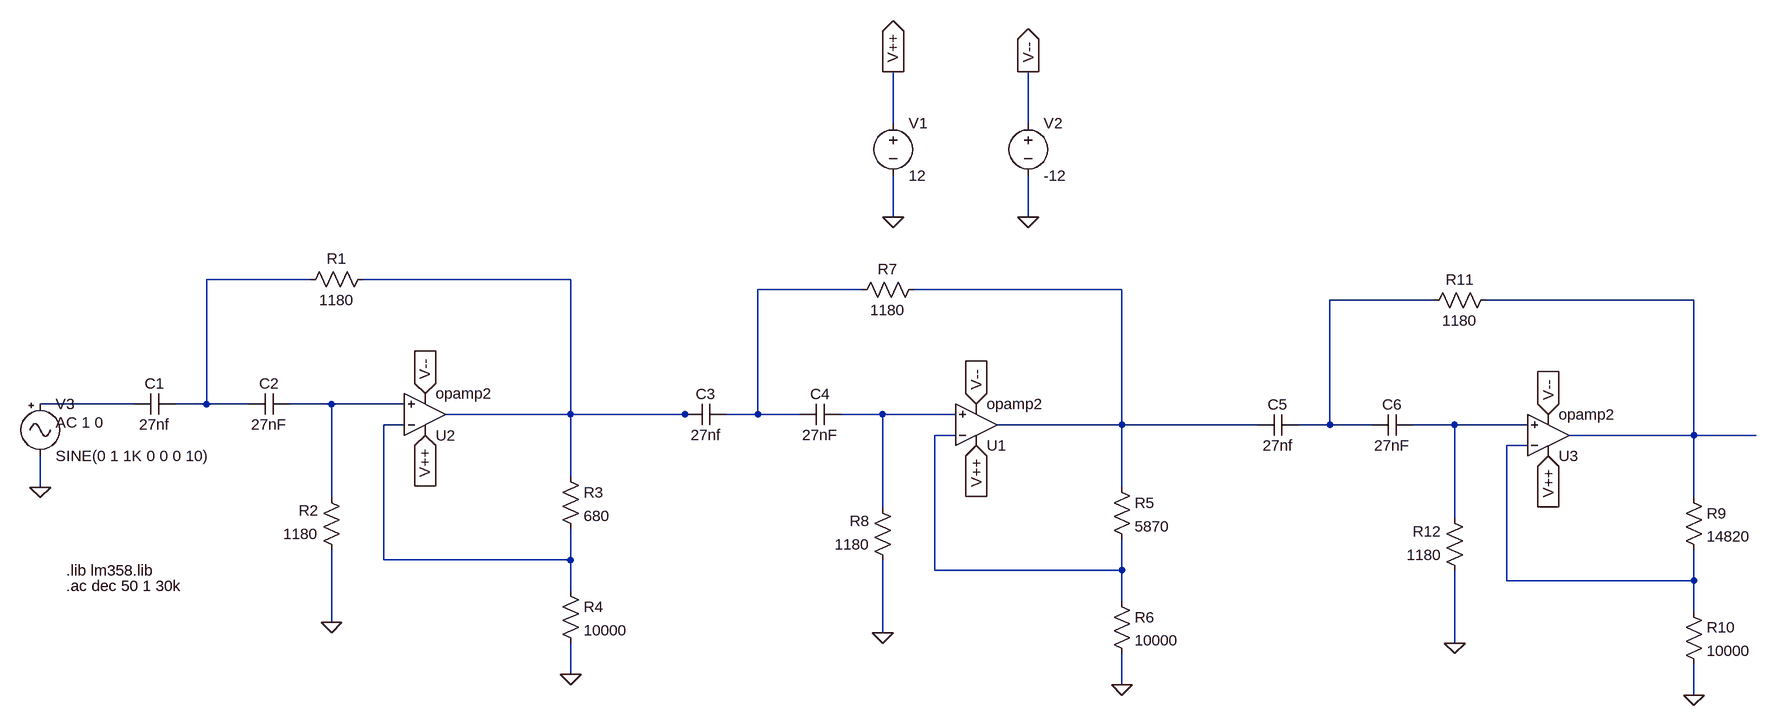
[diagram p0: schematic EEE3090F_2023_highPassFilter_GNGJOA003.asc]
EEE3090F_2023_highPassFilter_GNGJOA003.asc, the LTspice schematic file:
Version 4
SHEET 1 3012 680
WIRE 1072 -608 1072 -688
WIRE 1280 -608 1280 -688
WIRE 1072 -464 1072 -528
WIRE 1280 -464 1280 -528
WIRE 176 -368 16 -368
WIRE 576 -368 256 -368
WIRE 1024 -352 864 -352
WIRE 1424 -352 1104 -352
WIRE 1904 -336 1744 -336
WIRE 2304 -336 1984 -336
WIRE -96 -176 -240 -176
WIRE 16 -176 16 -368
WIRE 16 -176 -32 -176
WIRE 80 -176 16 -176
WIRE 208 -176 144 -176
WIRE 320 -176 208 -176
WIRE 576 -160 576 -368
WIRE 576 -160 384 -160
WIRE 752 -160 576 -160
WIRE 768 -160 752 -160
WIRE 864 -160 864 -352
WIRE 864 -160 816 -160
WIRE 928 -160 864 -160
WIRE 1056 -160 992 -160
WIRE 1168 -160 1056 -160
WIRE 320 -144 288 -144
WIRE 1424 -144 1424 -352
WIRE 1424 -144 1232 -144
WIRE 1632 -144 1424 -144
WIRE 1744 -144 1744 -336
WIRE 1744 -144 1696 -144
WIRE 1808 -144 1744 -144
WIRE 1936 -144 1872 -144
WIRE 2048 -144 1936 -144
WIRE 1168 -128 1136 -128
WIRE 2304 -128 2304 -336
WIRE 2304 -128 2112 -128
WIRE 2400 -128 2304 -128
WIRE 2048 -112 2016 -112
WIRE 576 -64 576 -160
WIRE -240 -48 -240 -96
WIRE 1424 -48 1424 -144
WIRE 208 -32 208 -176
WIRE 2304 -32 2304 -128
WIRE 1056 -16 1056 -160
WIRE 1936 0 1936 -144
WIRE 288 64 288 -144
WIRE 576 64 576 16
WIRE 576 64 288 64
WIRE 1136 80 1136 -128
WIRE 1424 80 1424 32
WIRE 1424 80 1136 80
WIRE 2016 96 2016 -112
WIRE 2304 96 2304 48
WIRE 2304 96 2016 96
WIRE 576 112 576 64
WIRE 1424 128 1424 80
WIRE 2304 144 2304 96
WIRE 208 160 208 48
WIRE 1056 176 1056 64
WIRE 1936 192 1936 80
WIRE 576 240 576 192
WIRE 1424 256 1424 208
WIRE 2304 272 2304 224
FLAG 208 160 0
FLAG 576 240 0
FLAG 352 -192 V--
IOPIN 352 -192 In
FLAG 352 -128 V++
IOPIN 352 -128 In
FLAG 1072 -464 0
FLAG 1280 -464 0
FLAG -240 -48 0
FLAG 1072 -688 V++
IOPIN 1072 -688 Out
FLAG 1280 -688 V--
IOPIN 1280 -688 Out
FLAG 1056 176 0
FLAG 1424 256 0
FLAG 1200 -176 V--
IOPIN 1200 -176 In
FLAG 1200 -112 V++
IOPIN 1200 -112 In
FLAG 1936 192 0
FLAG 2304 272 0
FLAG 2080 -160 V--
IOPIN 2080 -160 In
FLAG 2080 -96 V++
IOPIN 2080 -96 In
SYMBOL OpAmps\\opamp2 352 -96 M180
SYMATTR InstName U2
SYMBOL res 560 -80 R0
SYMATTR InstName R3
SYMATTR Value 680
SYMBOL res 560 96 R0
SYMATTR InstName R4
SYMATTR Value 10000
SYMBOL voltage 1072 -624 R0
WINDOW 123 0 0 Left 0
WINDOW 39 0 0 Left 0
SYMATTR InstName V1
SYMATTR Value 12
SYMBOL voltage 1280 -624 R0
WINDOW 123 0 0 Left 0
WINDOW 39 0 0 Left 0
SYMATTR InstName V2
SYMATTR Value -12
SYMBOL Misc\\signal -240 -192 R0
WINDOW 123 24 44 Left 2
WINDOW 39 0 0 Left 0
SYMATTR Value2 AC 1 0
SYMATTR InstName V3
SYMATTR Value SINE(0 1 1K 0 0 0 10)
SYMBOL cap -32 -192 R90
WINDOW 0 0 32 VBottom 2
WINDOW 3 32 32 VTop 2
SYMATTR InstName C1
SYMATTR Value 27nf
SYMBOL cap 144 -192 R90
WINDOW 0 0 32 VBottom 2
WINDOW 3 32 32 VTop 2
SYMATTR InstName C2
SYMATTR Value 27nF
SYMBOL res 272 -384 R90
WINDOW 0 0 56 VBottom 2
WINDOW 3 32 56 VTop 2
SYMATTR InstName R1
SYMATTR Value 1180
SYMBOL res 224 64 R180
WINDOW 0 36 76 Left 2
WINDOW 3 36 40 Left 2
SYMATTR InstName R2
SYMATTR Value 1180
SYMBOL OpAmps\\opamp2 1200 -80 M180
SYMATTR InstName U1
SYMBOL res 1408 -64 R0
SYMATTR InstName R5
SYMATTR Value 5870
SYMBOL res 1408 112 R0
SYMATTR InstName R6
SYMATTR Value 10000
SYMBOL cap 816 -176 R90
WINDOW 0 0 32 VBottom 2
WINDOW 3 32 32 VTop 2
SYMATTR InstName C3
SYMATTR Value 27nf
SYMBOL cap 992 -176 R90
WINDOW 0 0 32 VBottom 2
WINDOW 3 32 32 VTop 2
SYMATTR InstName C4
SYMATTR Value 27nF
SYMBOL res 1120 -368 R90
WINDOW 0 0 56 VBottom 2
WINDOW 3 32 56 VTop 2
SYMATTR InstName R7
SYMATTR Value 1180
SYMBOL res 1072 80 R180
WINDOW 0 36 76 Left 2
WINDOW 3 36 40 Left 2
SYMATTR InstName R8
SYMATTR Value 1180
SYMBOL OpAmps\\opamp2 2080 -64 M180
SYMATTR InstName U3
SYMBOL res 2288 -48 R0
SYMATTR InstName R9
SYMATTR Value 14820
SYMBOL res 2288 128 R0
SYMATTR InstName R10
SYMATTR Value 10000
SYMBOL cap 1696 -160 R90
WINDOW 0 0 32 VBottom 2
WINDOW 3 32 32 VTop 2
SYMATTR InstName C5
SYMATTR Value 27nf
SYMBOL cap 1872 -160 R90
WINDOW 0 0 32 VBottom 2
WINDOW 3 32 32 VTop 2
SYMATTR InstName C6
SYMATTR Value 27nF
SYMBOL res 2000 -352 R90
WINDOW 0 0 56 VBottom 2
WINDOW 3 32 56 VTop 2
SYMATTR InstName R11
SYMATTR Value 1180
SYMBOL res 1952 96 R180
WINDOW 0 36 76 Left 2
WINDOW 3 36 40 Left 2
SYMATTR InstName R12
SYMATTR Value 1180
TEXT -200 80 Left 2 !.lib lm358.lib
TEXT -200 104 Left 2 !.ac dec 50 1 30k

The netlist it stands for:
* EEE3090F_2023_highPassFilter_GNGJOA003.asc
XU2 N008 N010 V++ V-- N002 opamp2  ; pins In+ In- V+ V- OUT
R3 N002 N010 680
R4 N010 0 10000
V1 V++ 0 12
V2 V-- 0 -12
V3 N007 0 SINE(0 1 1K 0 0 0 10) AC 1 0
C1 N001 N007 27nf
C2 N008 N001 27nF
R1 N002 N001 1180
R2 0 N008 1180
XU1 N009 N012 V++ V-- N004 opamp2  ; pins In+ In- V+ V- OUT
R5 N004 N012 5870
R6 N012 0 10000
C3 N003 N002 27nf
C4 N009 N003 27nF
R7 N004 N003 1180
R8 0 N009 1180
XU3 N011 N013 V++ V-- N006 opamp2  ; pins In+ In- V+ V- OUT
R9 N006 N013 14820
R10 N013 0 10000
C5 N005 N004 27nf
C6 N011 N005 27nF
R11 N006 N005 1180
R12 0 N011 1180
.lib lm358.lib
.ac dec 50 1 30k
.backanno
.end